# EAGLE design project 1 (EAGLE 9.6.2)
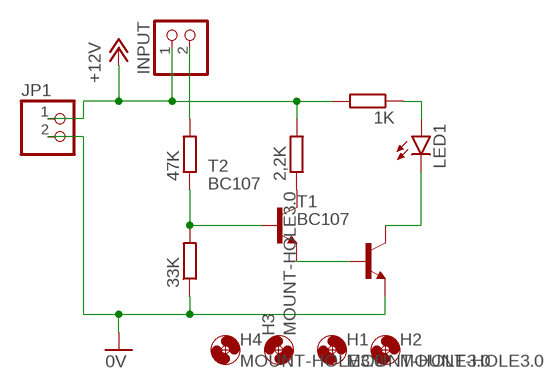
[diagram p0: schematic, sheet 1]

## Parts
1K  R-EU_0207/12  [0207/12]
2,2K  R-EU_0207/15  [0207/15]
33K  R-EU_0207/15  [0207/15]
47K  R-EU_0207/15  [0207/15]
H1  MOUNT-HOLE3.0  [3,0]
H2  MOUNT-HOLE3.0  [3,0]
H3  MOUNT-HOLE3.0  [3,0]
H4  MOUNT-HOLE3.0  [3,0]
INPUT  PINHD-1X2  [1X02]
JP1  PINHD-1X2  [1X02]
LED1  LED5MM  [LED5MM]
T1  BC107  [TO18]
T2  BC107  [TO18]

## Nets
0V: 33K.1 JP1.2 T1.1(E)
+12V: 1K.2 2,2K.2 INPUT.1 JP1.1
N$1: 47K.2 INPUT.2
N$3: 33K.2 47K.1 T2.2(B)
N$5: 2,2K.1 T2.3(C)
N$6: T1.2(B) T2.1(E)
N$7: LED1.K(C) T1.3(C)
N$8: 1K.1 LED1.A

## Library data of the parts
1K 2,2K 33K 47K = rcl:R-EU_: RESISTOR, European symbol; SPICEPREFIX: R
H1-H4 = holes:MOUNT-HOLE: MOUNTING HOLE with drill center marker
INPUT JP1 = pinhead:PINHD-1X2: PIN HEADER
LED1 = led:LED: LED OSRAM: - CHIPLED LG R971, LG N971, LY N971, LG Q971, LY Q971, LO R971, LY R971 LH N974, LH R974 LS Q976, LO Q976, LY Q976 LO Q996 - Hyper CHIPLED LW Q18S LB Q993, LB Q99A, LB R99A - SideLED LS A670, LO A670, LY A670, LG A670, LP A670 LB A673, LV A673, LT A673, LW A673 LH A674 LY A675 LS A676, LA A676, LO A676, LY A676, LW A676 LS A679, LY A679, LG A679 - Hyper Micro SIDELED® LS Y876, LA Y876, LO Y876, LY Y876 LT Y87S - SmartLED LW L88C, LW L88S LB L89C, LB L89S, LG L890 LS L89K, LO L89K, LY L89K LS L896, LA L896, LO L896, LY L896 - TOPLED LS T670, LO T670, LY T670, LG T670, LP T670 LSG T670, LSP T670, LSY T670, LOP T670, LYG T670 LG T671, LOG T671, LSG T671 LB T673, LV T673, LT T673, LW T673 LH T674 LS T676, LA T676, LO T676, LY T676, LB T676, LH T676, LSB T676, LW T676 LB T67C, LV T67C, LT T67C, LS T67K, LO T67K, LY T67K, LW E67C LS E67B, LA E67B, LO E67B, LY E67B, LB E67C, LV E67C, LT E67C LW T67C LS T679, LY T679, LG T679 LS T770, LO T770, LY T770, LG T770, LP T770 LB T773, LV T773, LT T773, LW T773 LH T774 LS E675, LA E675, LY E675, LS T675 LS T776, LA T776, LO T776, LY T776, LB T776 LHGB T686 LT T68C, LB T68C - Hyper Mini TOPLED® LB M676 - Mini TOPLED Santana® LG M470 LS M47K, LO M47K, LY M47K Source: http://www.osram.convergy.de LUXEON: - LUMILED® LXK2-PW12-R00, LXK2-PW12-S00, LXK2-PW14-U00, LXK2-PW14-V00 LXK2-PM12-R00, LXK2-PM12-S00, LXK2-PM14-U00 LXK2-PE12-Q00, LXK2-PE12-R00, LXK2-PE12-S00, LXK2-PE14-T00, LXK2-PE14-U00 LXK2-PB12-K00, LXK2-PB12-L00, LXK2-PB12-M00, LXK2-PB14-N00, LXK2-PB14-P00, LXK2-PB14-Q00 LXK2-PR12-L00, LXK2-PR12-M00, LXK2-PR14-Q00, LXK2-PR14-R00 LXK2-PD12-Q00, LXK2-PD12-R00, LXK2-PD12-S00 LXK2-PH12-R00, LXK2-PH12-S00 LXK2-PL12-P00, LXK2-PL12-Q00, LXK2-PL12-R00 Source: www.luxeon.com KINGBRIGHT: KA-3528ASYC Source: www.kingbright.com
T1 T2 = transistor:BC107: NPN TRANSISTOR

## Board
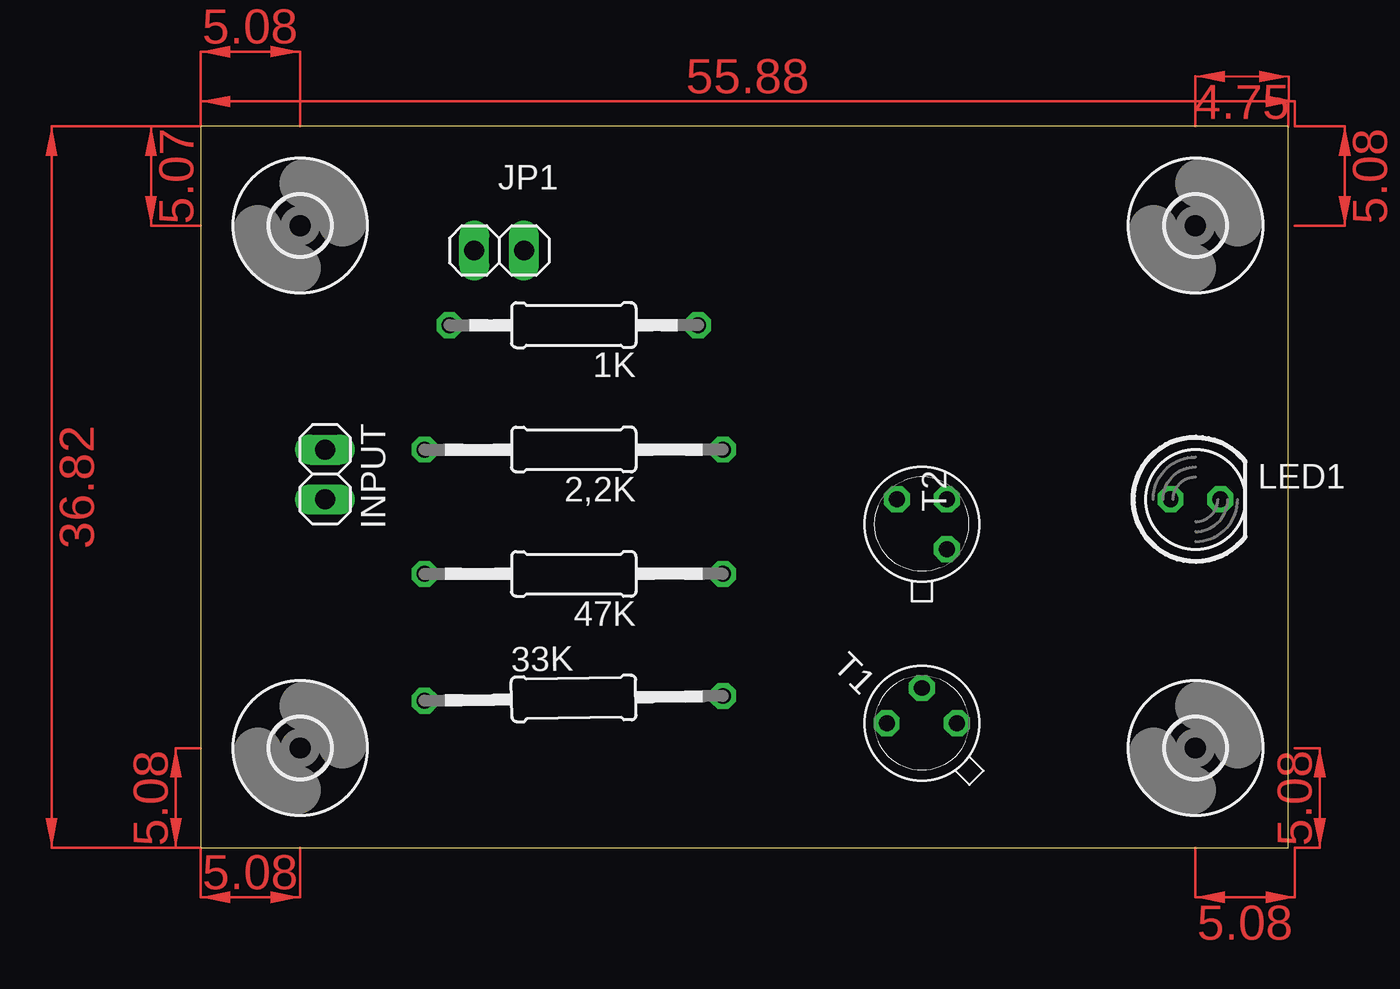
[diagram p1: board, top side]
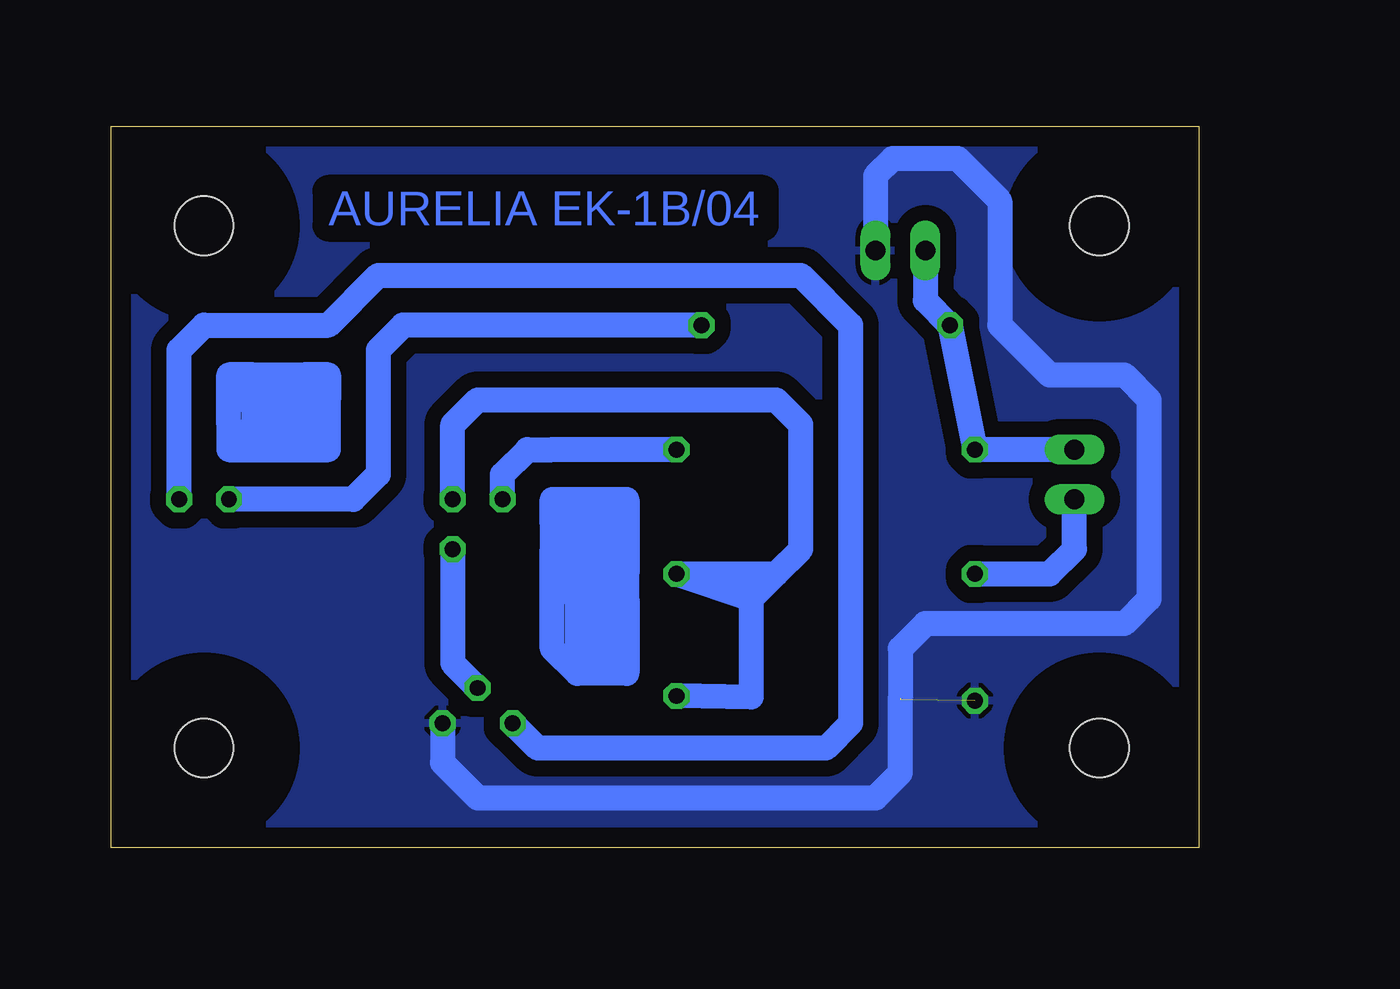
[diagram p2: board, bottom side, seen from below]

Size 55.55 x 36.82 mm. Coordinates in mm from the lower left corner, seen from the top.
Outline: 0,0 55.55,0 55.55,36.82 0,36.82 0,0
Copper layers (1*16): Top 0.035mm / dielectric 1.5mm / Bottom 0.035mm
Design rules "default *": minimum track width 6mil, minimum drill 0.35mm, track to track 15mil, track to pad 15mil, pad to pad 15mil, via to via 15mil, smd to smd 6mil, copper to edge 40mil, drill to drill 6mil, minimum pad ring 10mil, minimum via ring 8mil, stop-mask expansion 4mil, vias tented up to drill 0mil, thermal gap 10mil

### Footprints (pad centres in the part's own frame; a part is rotated, then mirrored left to right if it is on the bottom)
0207/12 = drill 0.813 octagon: 1 -6.35,0; 2 6.35,0
0207/15 = drill 0.813 octagon: 1 -7.62,0; 2 7.62,0
3,0 = hole 3: 0,0
1X02 = drill 1.016 long: 1 -1.27,0; 2 1.27,0
LED5MM = drill 0.813 octagon: A -1.27,0; K 1.27,0
TO18 = drill 0.813 octagon: 1 -1.27,-1.27; 2 1.27,-1.27; 3 1.27,1.27

### Placement (x,y rotation side)
1K  19.05,26.67 180 top
2,2K  19.05,20.32 180 top
33K  19.05,7.62 0.9 top
47K  19.05,13.97 180 top
H1  5.08,5.08 0 top
H2  50.8,5.08 0 top
H3  50.8,31.75 0 top
H4  5.08,31.75 0 top
INPUT  6.35,19.05 270 top
JP1  15.24,30.48 0 top
LED1  50.8,17.78 0 top
T1  36.83,6.35 135 top
T2  36.83,16.51 90 top

### Tracks (layer width: path | path; a pad name or v marks a point on that pad's centre or on a via)
0V  (2 unrouted)
  Bottom 1.27: T1.1 38.63,4.34 36.83,2.54 16.51,2.54 15.24,3.81 15.24,7.56 | 15.24,7.62 15.24,10.16 13.97,11.43 3.81,11.43 2.54,12.7 2.54,22.86 3.81,24.13 7.62,24.13 10.16,26.67 10.16,33.02 12.31,35.17 15.63,35.17 16.51,34.29 JP1.2
  pour Bottom (isolate 0.813): 0,36.83 55.88,36.83 55.88,0 0,0
+12V
  Bottom 1.27: INPUT.1 2,2K.2 1K.2 13.97,27.94 JP1.1
N$1
  Bottom 1.27: INPUT.2 6.35,15.24 7.62,13.97 47K.2
N$2
  Bottom 1.27: 29.21,15.24 29.21,13.97 | 29.21,12.7 29.21,11.43 | 29.21,11.43 29.21,10.16 | 29.21,10.16 29.21,8.89 | 29.21,8.89 31.75,8.89 | 31.75,8.89 33.02,10.16 33.02,13.97 | 33.02,17.78 31.75,17.78 | 31.75,17.78 30.48,17.78 | 30.48,17.78 29.21,17.78 | 31.75,16.51 33.02,16.51 | 33.02,16.51 33.02,15.24 | 33.02,15.24 31.75,15.24 | 31.75,15.24 30.48,15.24 | 29.21,16.51 29.21,15.24 | 33.02,15.24 31.75,13.97 | 29.21,13.97 30.48,12.7 | 30.48,12.7 31.75,12.7 | 31.75,12.7 31.75,11.43 | 30.48,10.16 29.21,10.16 | 30.48,11.43 31.75,11.43 | 31.75,12.7 33.02,13.97 | 33.02,13.97 33.02,15.24 | 33.02,16.51 33.02,17.78 | 33.02,17.78 31.75,16.51 | 31.75,16.51 30.48,15.24 | 30.48,15.24 30.48,13.97 | 29.21,10.16 30.48,11.43 | 29.21,11.43 30.48,12.7 | 30.48,12.7 29.21,12.7 | 29.21,12.7 29.21,13.97 | 29.21,13.97 30.48,13.97 | 30.48,13.97 31.75,13.97 | 30.48,15.24 29.21,15.24 | 29.21,15.24 30.48,16.51 | 30.48,16.51 31.75,16.51 | 31.75,16.51 31.75,15.24 | 30.48,15.24 30.48,16.51 | 29.21,16.51 30.48,16.51 | 33.02,16.51 31.75,17.78 | 31.75,17.78 31.75,16.51 | 31.75,16.51 30.48,17.78 | 30.48,17.78 30.48,16.51 | 30.48,16.51 29.21,17.78 | 29.21,17.78 29.21,16.51 | 29.21,16.51 30.48,15.24 | 31.75,10.16 31.75,8.89 | 29.21,8.89 30.48,10.16 | 31.75,10.16 30.48,10.16 | 31.75,15.24 31.75,13.97 | 31.75,12.7 30.48,11.43 | 30.48,11.43 30.48,10.16 | 30.48,15.24 31.75,13.97 | 31.75,13.97 31.75,12.7 | 31.75,11.43 31.75,10.16 | 31.75,8.89 30.48,10.16 | 30.48,11.43 30.48,12.7 | 30.48,13.97 30.48,12.7 | 30.48,12.7 31.75,11.43
N$3
  Bottom 1.27: 22.86,12.7 47K.1 21.59,13.97 | T2.2 38.1,21.59 36.83,22.86 21.59,22.86 20.32,21.59 20.32,15.24 21.59,13.97 | 21.59,13.97 22.86,12.7 | 33K.2 22.86,7.68 22.86,12.7
N$4
  Bottom 1.27: 49.53,21.59 49.53,20.32 | 46.99,20.32 45.72,20.32 | 45.72,20.32 44.45,20.32 44.45,21.59 | 45.72,22.86 46.99,21.59 | 48.26,22.86 46.99,21.59 | 46.99,21.59 45.72,21.59 | 45.72,21.59 44.45,21.59 | 44.45,21.59 45.72,22.86 | 45.72,22.86 46.99,22.86 | 46.99,22.86 48.26,22.86 | 48.26,22.86 48.26,21.59 | 48.26,21.59 49.53,20.32 | 49.53,20.32 48.26,20.32 | 44.45,21.59 44.45,22.86 | 44.45,24.13 45.72,24.13 | 48.26,24.13 49.53,24.13 | 48.26,20.32 46.99,20.32 | 46.99,20.32 48.26,21.59 | 48.26,21.59 46.99,21.59 | 45.72,20.32 45.72,21.59 | 45.72,21.59 46.99,20.32 | 48.26,20.32 49.53,21.59 | 49.53,21.59 49.53,22.86 | 48.26,22.86 46.99,24.13 | 48.26,24.13 46.99,24.13 | 45.72,22.86 44.45,24.13 | 44.45,24.13 44.45,22.86 | 44.45,22.86 45.72,22.86 | 48.26,22.86 49.53,22.86 | 49.53,22.86 49.53,24.13 | 49.53,24.13 48.26,22.86 | 48.26,22.86 48.26,24.13 | 48.26,24.13 46.99,22.86 | 46.99,22.86 46.99,24.13 | 45.72,24.13 45.72,22.86 | 45.72,22.86 46.99,24.13 | 46.99,24.13 45.72,24.13
N$5
  Bottom 1.27: 2,2K.1 31.75,20.32 33.02,20.32 34.29,20.32 35.56,19.05 T2.3
N$6
  Bottom 1.27: T2.1 38.1,9.42 T1.2
N$7
  Bottom 1.27: LED1.K 52.07,25.4 50.8,26.67 44.45,26.67 41.91,29.21 20.32,29.21 17.78,26.67 17.78,6.35 19.05,5.08 33.76,5.08 T1.3
N$8
  Bottom 1.27: 1K.1 40.64,26.67 41.91,25.4 41.91,19.05 43.18,17.78 LED1.A
(copper drawn outside any net)
  shapes: Top area x10

### Text on the board
Bottom: AURELIA EK-1B/04